# Altium schematic sheet 48VSensing.SchDoc
size A
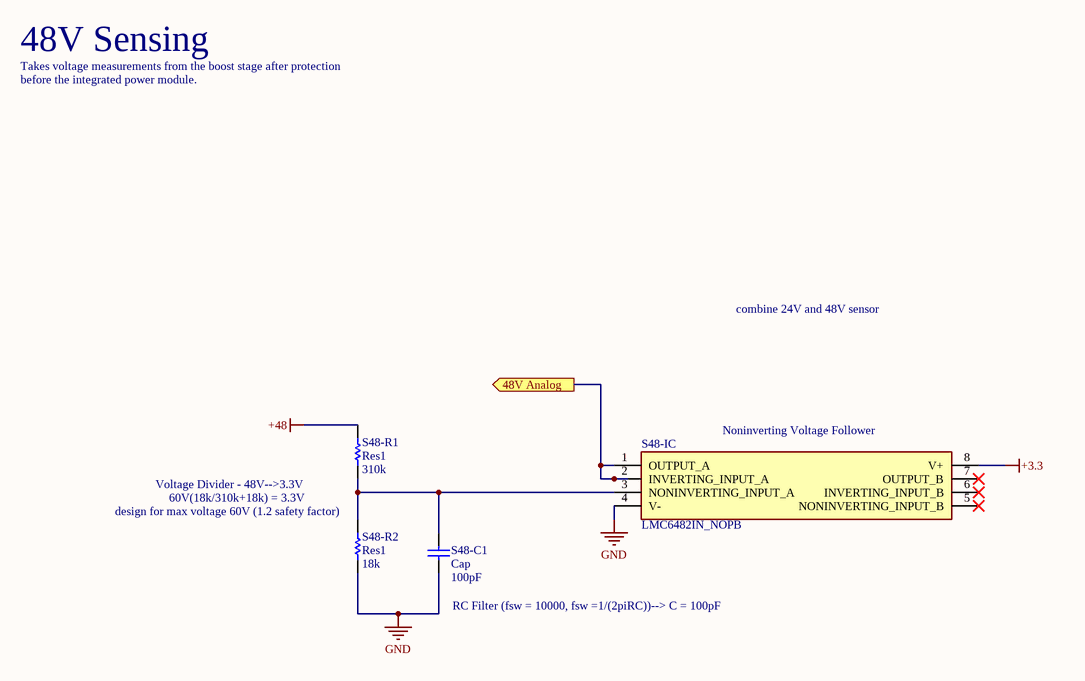
[diagram p0: 48VSensing.SchDoc]

## Parts
S48-C1  Cap  value 100pF  [RAD-0.3]
S48-IC  LMC6482IN_NOPB  [DIP794W53P254L959H508Q8N]
S48-R1  Res1  value 310k  [AXIAL-0.3]
S48-R2  Res1  value 18k  [AXIAL-0.3]

## Ports
48V Analog (out)

## Nets
+3.3: S48-IC.8(V+)
+48: S48-R1.2
GND: S48-C1.1 S48-IC.4(V-) S48-R2.1
48V Analog: S48-IC.1(OUTPUT_A) S48-IC.2(INVERTING_INPUT_A) ; port 48V Analog
NetS48-C1_2: S48-C1.2 S48-IC.3(NONINVERTING_INPUT_A) S48-R1.1 S48-R2.2

Not connected (* = marked no-connect by the designer): S48-IC 5(NONINVERTING_INPUT_B)* 6(INVERTING_INPUT_B)* 7(OUTPUT_B)*

## Notes on the sheet
- 48V Sensing
- Takes voltage measurements from the boost stage after protection
- before the integrated power module.
- combine 24V and 48V sensor
- (near S48-IC) Noninverting Voltage Follower
- (near S48-R2) design for max voltage 60V (1.2 safety factor)
- Voltage Divider - 48V-->3.3V
- 60V(18k/310k+18k) = 3.3V
- (near S48-C1) RC Filter (fsw = 10000, fsw =1/(2piRC))--> C = 100pF

## Library data of the parts
S48-C1 = Cap: Capacitor; Published: 8-Jun-2000; LatestRevisionDate: 17-Jul-2002; LatestRevisionNote: Re-released for DXP Platform.; PackageReference: RAD-0.3; Publisher: Altium Limited; PackageDescription: Radial Cap, Thru-Hole; 2 Leads; 0.3 in Pin Spacing
S48-IC = LMC6482IN_NOPB: Integrated Circuit; Manufacturer_Name: Texas Instruments; Manufacturer_Part_Number: LMC6482IN/NOPB; Datasheet Link: http://www.ti.com/lit/gpn/lmc6482; Height: 5.08mm; Mouser Part Number: 926-LMC6482IN/NOPB; Mouser Price/Stock: https://www.mouser.co.uk/ProductDetail/Texas-Instruments/LMC6482IN-NOPB?qs=QbsRYf82W3EByDDrj8Vijg%3D%3D; Arrow Part Number: LMC6482IN/NOPB; Arrow Price/Stock: https://www.arrow.com/en/products/lmc6482innopb/texas-instruments
S48-R1 S48-R2 = Res1: Resistor; Published: 8-Jun-2000; LatestRevisionDate: 17-Jul-2002; LatestRevisionNote: Re-released for DXP Platform.; PackageReference: AXIAL-0.3; Publisher: Altium Limited; PackageDescription: Axial Device, Thru-Hole; 2 Leads; 0.3 in Pin Spacing